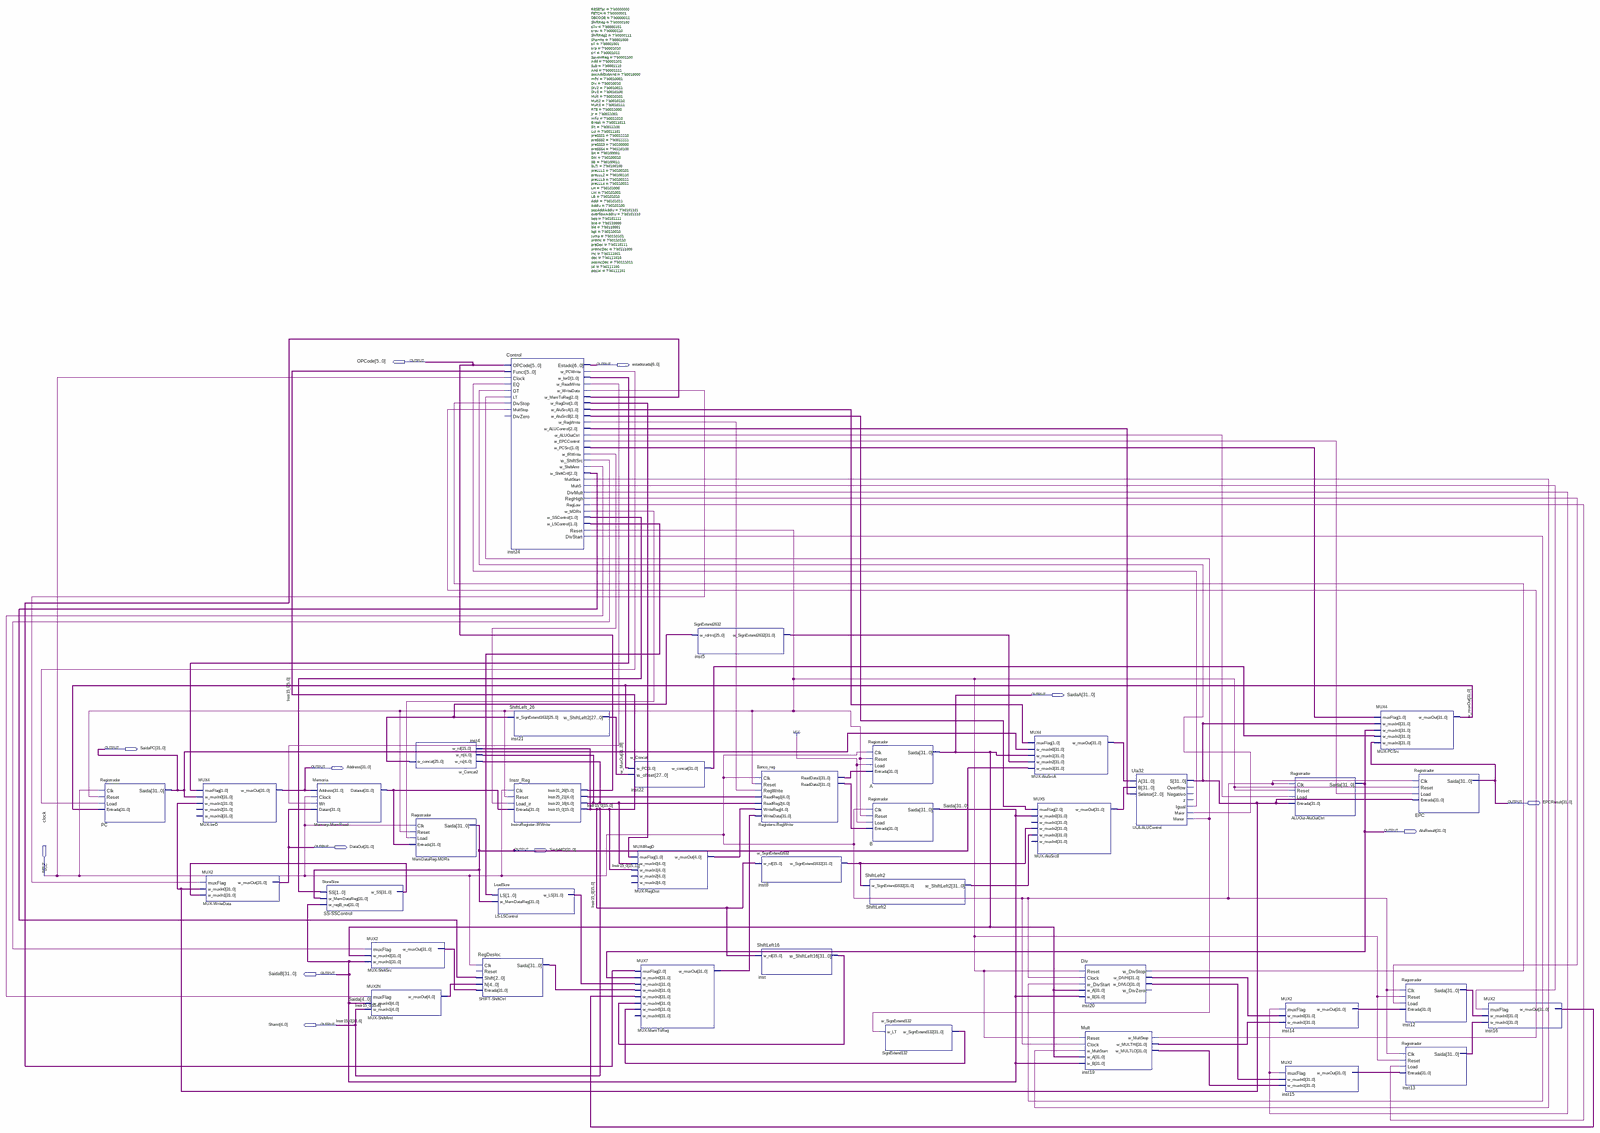
[diagram p0: schematic sheet, whole]
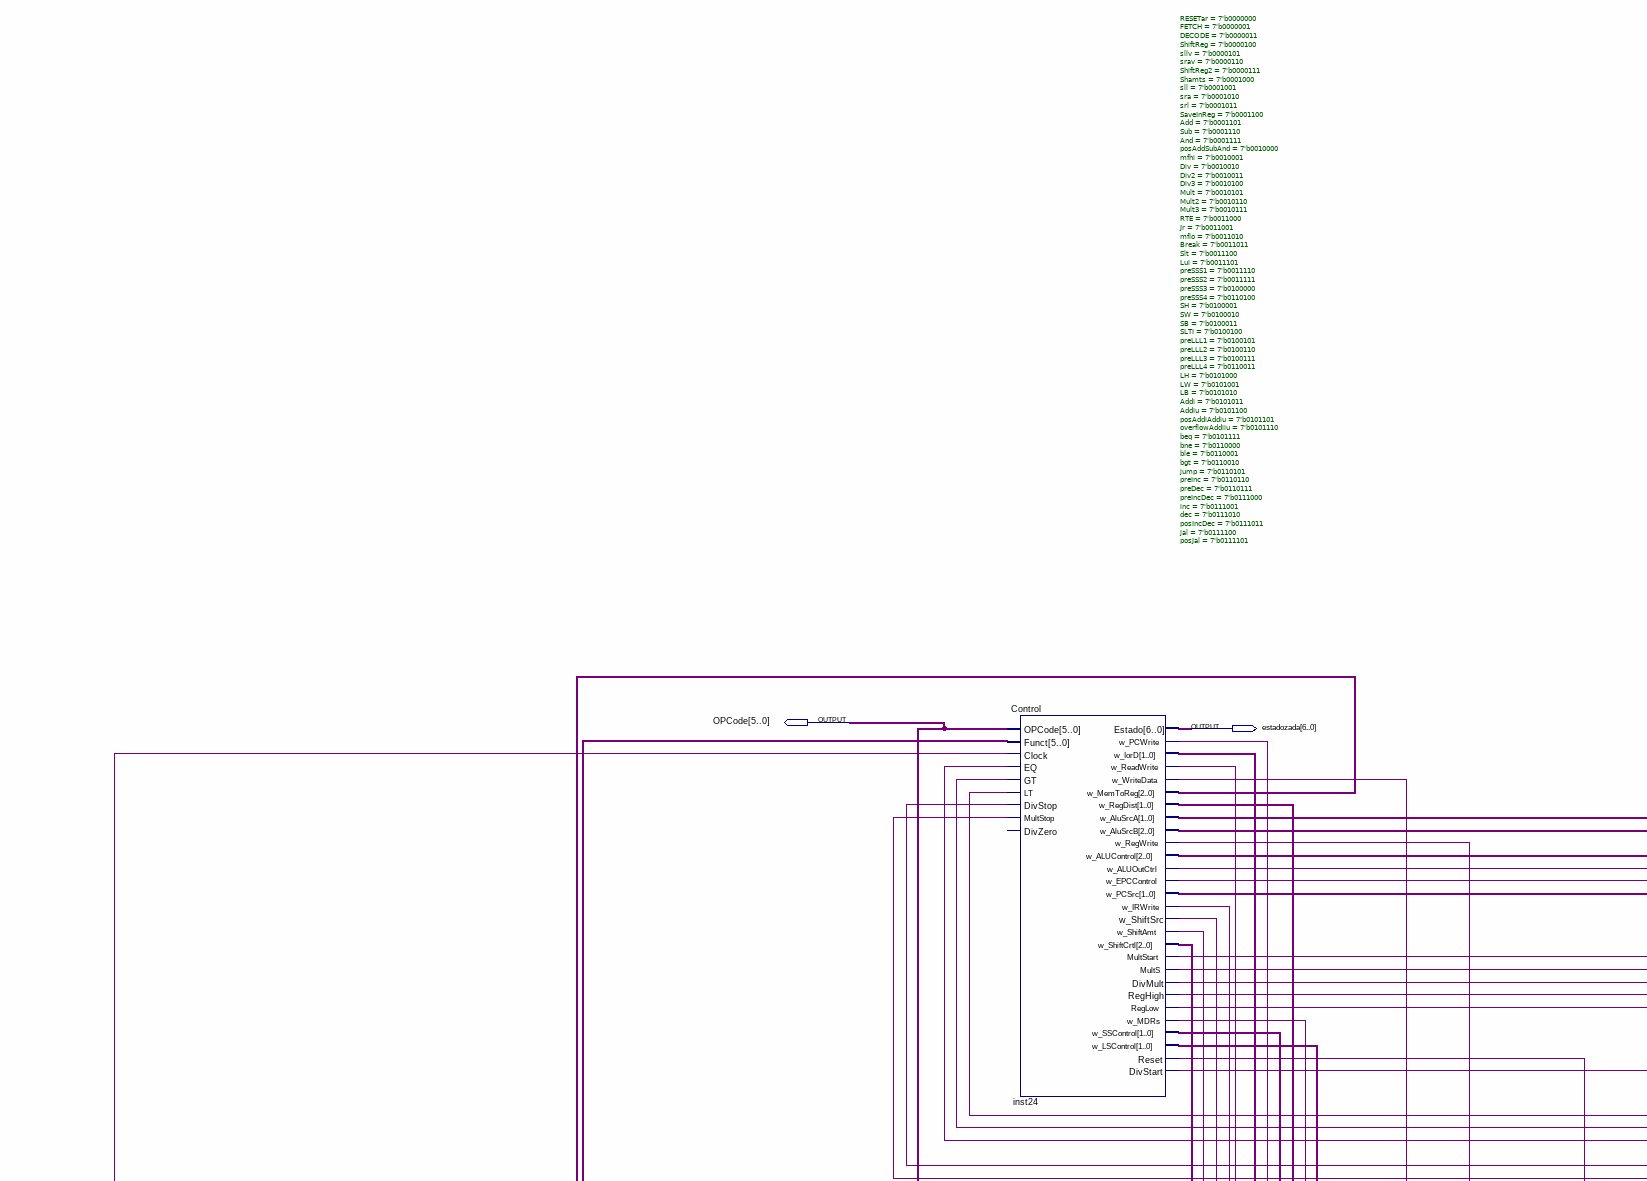
[diagram p1: schematic sheet, upper left part]
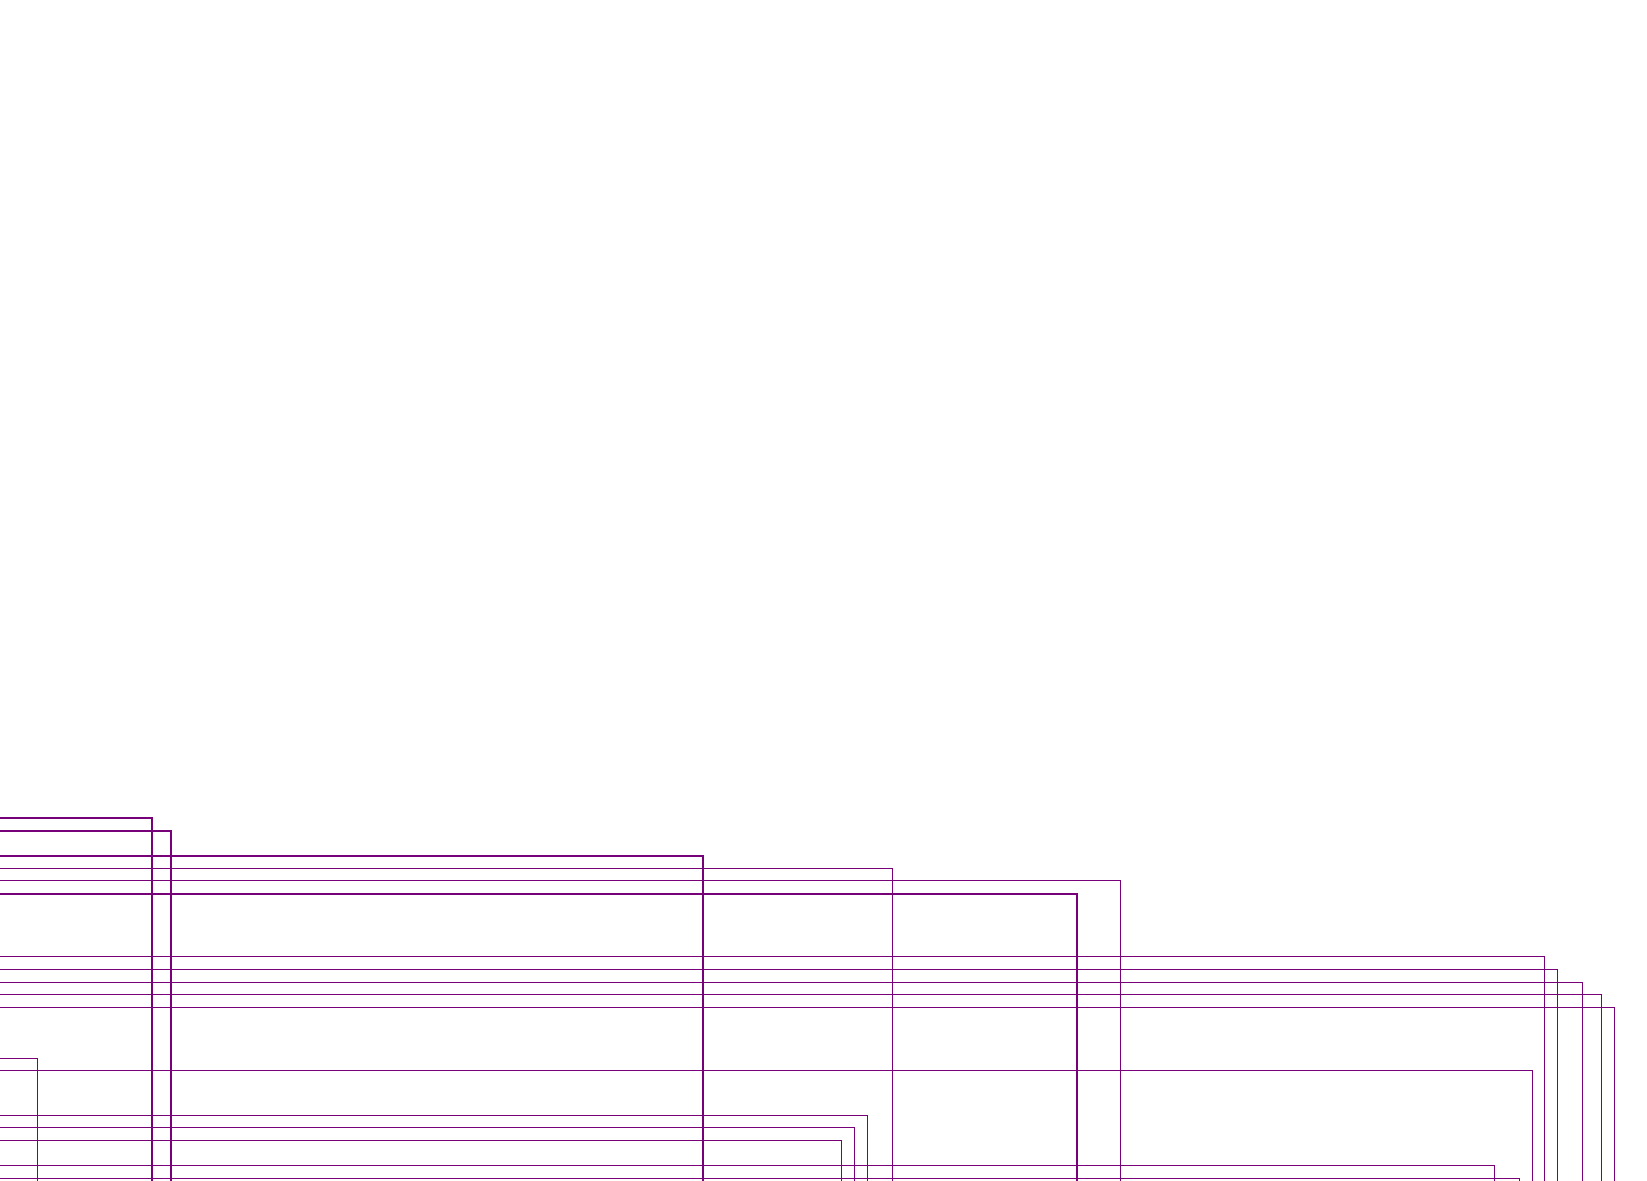
[diagram p2: schematic sheet, upper right part]
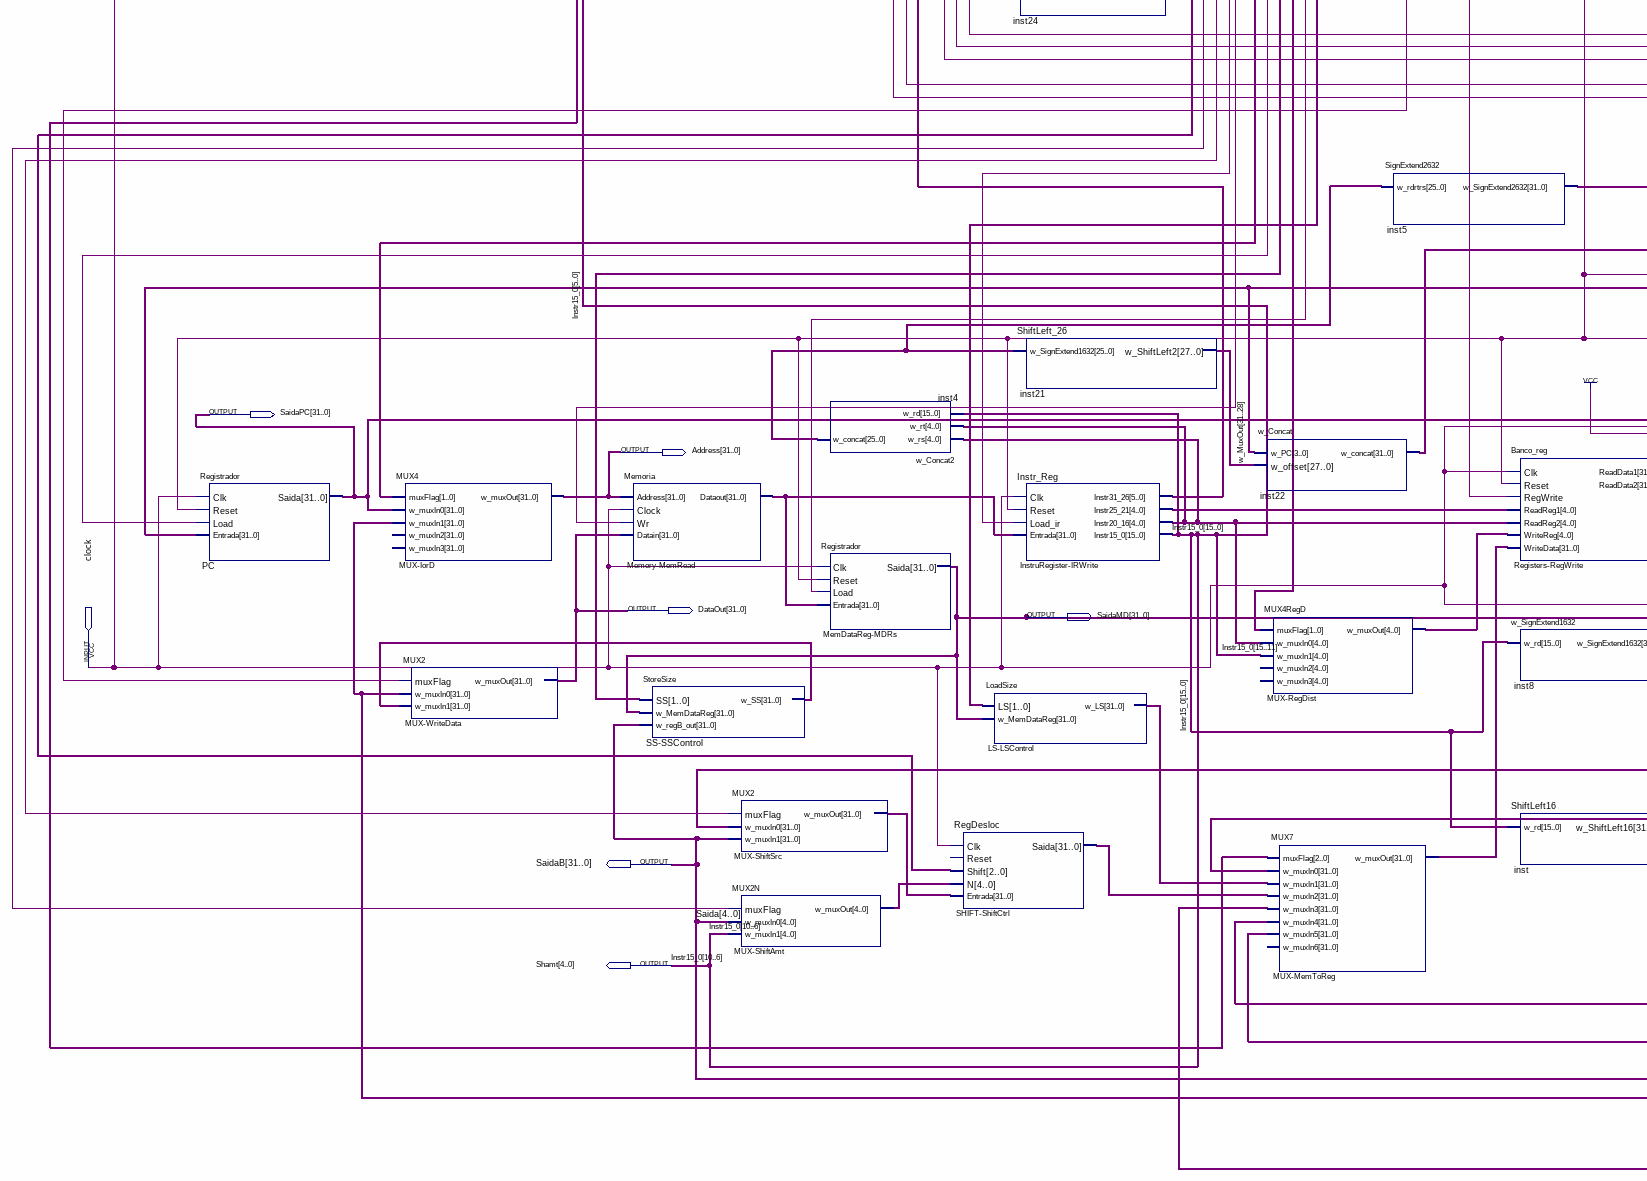
[diagram p3: schematic sheet, lower left part]
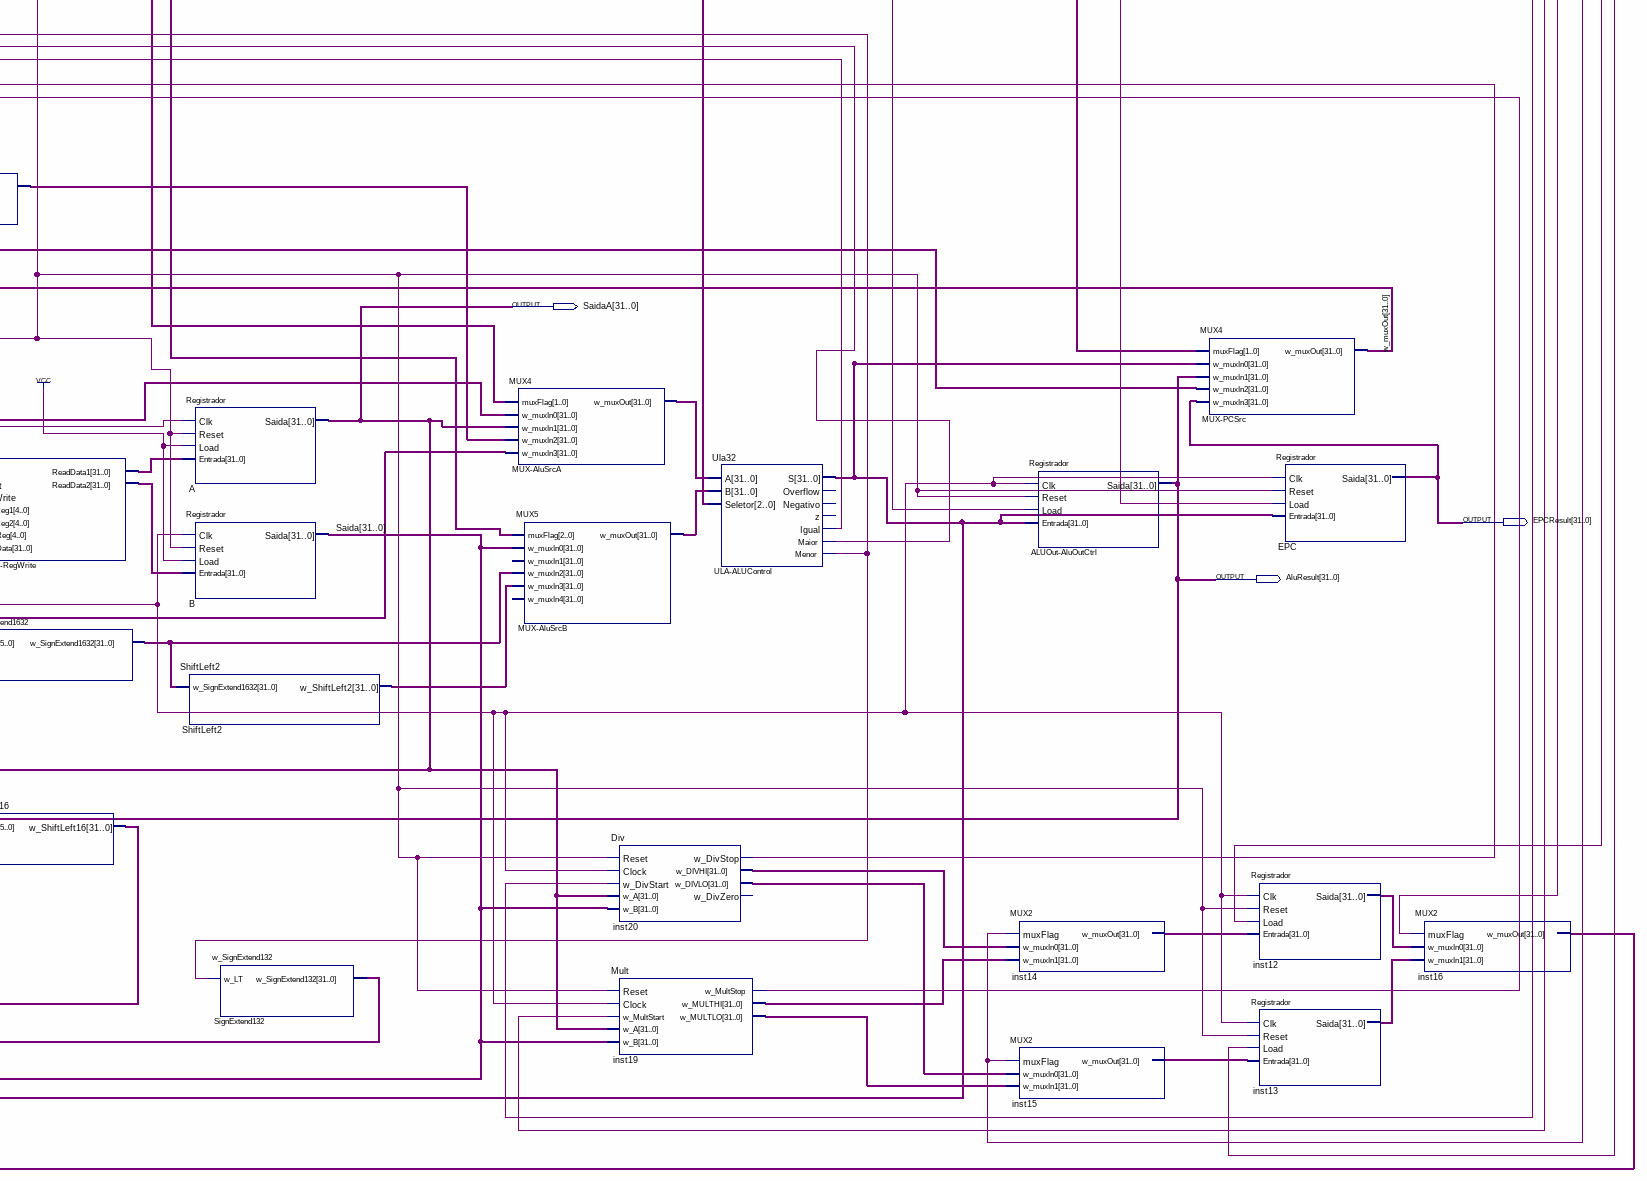
[diagram p4: schematic sheet, lower right part]
// Quartus schematic CPUbloco.bdf as structural Verilog: 38 symbols, 12 pins
module CPUbloco (
  input  clock,
  output [5:0] OPCode,
  output [6:0] estadozada,
  output [31:0] SaidaA,
  output [31:0] SaidaPC,
  output [31:0] Address,
  output [31:0] EPCResult,
  output [31:0] AluResult,
  output [31:0] DataOut,
  output [31:0] SaidaMD,
  output [31:0] SaidaB,
  output [4:0] Shamt
);

  wire inst19_w_multstop, inst20_w_divstop, inst24_divmult, inst24_divstart, inst24_mults, inst24_multstart,
       inst24_reghigh, inst24_reglow, inst24_reset, inst24_w_aluoutctrl, inst24_w_epccontrol,
       inst24_w_irwrite, inst24_w_mdrs, inst24_w_pcwrite, inst24_w_readwrite, inst24_w_regwrite,
       inst24_w_shiftamt, inst24_w_shiftsrc, inst24_w_writedata, ULA_ALUControl_igual, ULA_ALUControl_maior,
       ULA_ALUControl_menor;
  wire [1:0] inst24_w_alusrca, inst24_w_iord, inst24_w_lscontrol, inst24_w_pcsrc, inst24_w_regdist,
       inst24_w_sscontrol;
  wire [2:0] inst24_w_alucontrol, inst24_w_alusrcb, inst24_w_memtoreg, inst24_w_shiftcrtl;
  wire [4:0] InstruRegister_IRWrite_instr20_16, InstruRegister_IRWrite_instr25_21, MUX_RegDist_w_muxout,
       MUX_ShiftAmt_w_muxout;
  wire [15:0] Instr15_0;
  wire [25:0] inst4_w_concat;
  wire [27:0] inst21_w_shiftleft2;
  wire [31:0] inst5_w_signextend2632, inst8_w_signextend1632, inst12_saida, inst13_saida, inst14_w_muxout,
       inst15_w_muxout, inst16_w_muxout, inst19_w_multhi, inst19_w_multlo, inst20_w_divhi, inst20_w_divlo,
       inst22_w_concat, inst_w_shiftleft16, LS_LSControl_w_ls, Memory_MemRead_dataout, MUX_AluSrcA_w_muxout,
       MUX_AluSrcB_w_muxout, MUX_MemToReg_w_muxout, MUX_ShiftSrc_w_muxout, Registers_RegWrite_readdata1,
       Registers_RegWrite_readdata2, SHIFT_ShiftCtrl_saida, ShiftLeft2_w_shiftleft2,
       SignExtend132_w_signextend132, SS_SSControl_w_ss, ULA_ALUControl_s, w_MuxOut;

  Registrador PC (.Clk(clock), .Reset(inst24_reset), .Load(inst24_w_pcwrite), .Entrada(w_MuxOut), .Saida(SaidaPC));
  MUX4 \MUX-IorD  (
    .muxFlag(inst24_w_iord), .w_muxIn0(SaidaPC), .w_muxIn1(ULA_ALUControl_s), .w_muxOut(Address));  // open: w_muxIn2, w_muxIn3
  MUX2 \MUX-WriteData  (
    .muxFlag(inst24_w_writedata), .w_muxIn0(ULA_ALUControl_s), .w_muxIn1(SS_SSControl_w_ss),
    .w_muxOut(DataOut));
  Memoria \Memory-MemRead  (
    .Address(Address), .Clock(clock), .Wr(inst24_w_readwrite), .Datain(DataOut),
    .Dataout(Memory_MemRead_dataout));
  StoreSize \SS-SSControl  (
    .SS(inst24_w_sscontrol), .w_MemDataReg(SaidaMD), .w_regB_out(SaidaB), .w_SS(SS_SSControl_w_ss));
  MUX2 \MUX-ShiftSrc  (
    .muxFlag(inst24_w_shiftsrc), .w_muxIn0(SaidaA), .w_muxIn1(SaidaB), .w_muxOut(MUX_ShiftSrc_w_muxout));
  MUX2N \MUX-ShiftAmt  (
    .muxFlag(inst24_w_shiftamt), .w_muxIn0(SaidaB[4:0]), .w_muxIn1(Shamt), .w_muxOut(MUX_ShiftAmt_w_muxout));
  w_Concat2 inst4 (
    .w_rs(InstruRegister_IRWrite_instr20_16), .w_rt(InstruRegister_IRWrite_instr20_16),
    .w_rd({Instr15_0[15:11], Shamt, Instr15_0[5:0]}), .w_concat(inst4_w_concat));
  Registrador \MemDataReg-MDRs  (
    .Clk(clock), .Reset(inst24_reset), .Load(inst24_w_mdrs), .Entrada(Memory_MemRead_dataout), .Saida(SaidaMD));
  LoadSize \LS-LSControl  (.LS(inst24_w_lscontrol), .w_MemDataReg(SaidaMD), .w_LS(LS_LSControl_w_ls));
  RegDesloc \SHIFT-ShiftCtrl  (
    .Clk(clock), .Shift(inst24_w_shiftcrtl), .N(MUX_ShiftAmt_w_muxout), .Entrada(MUX_ShiftSrc_w_muxout),
    .Saida(SHIFT_ShiftCtrl_saida));  // open: Reset
  Control #(.RESETar(7'b0000000), .FETCH(7'b0000001), .DECODE(7'b0000011), .ShiftReg(7'b0000100), .sllv(7'b0000101), .srav(7'b0000110), .ShiftReg2(7'b0000111), .Shamts(7'b0001000), .sll(7'b0001001), .sra(7'b0001010), .srl(7'b0001011), .SaveInReg(7'b0001100), .Add(7'b0001101), .Sub(7'b0001110), .And(7'b0001111), .posAddSubAnd(7'b0010000), .mfhi(7'b0010001), .Div(7'b0010010), .Div2(7'b0010011), .Div3(7'b0010100), .Mult(7'b0010101), .Mult2(7'b0010110), .Mult3(7'b0010111), .RTE(7'b0011000), .Jr(7'b0011001), .mflo(7'b0011010), .Break(7'b0011011), .Slt(7'b0011100), .Lui(7'b0011101), .preSSS1(7'b0011110), .preSSS2(7'b0011111), .preSSS3(7'b0100000), .preSSS4(7'b0110100), .SH(7'b0100001), .SW(7'b0100010), .SB(7'b0100011), .SLTI(7'b0100100), .preLLL1(7'b0100101), .preLLL2(7'b0100110), .preLLL3(7'b0100111), .preLLL4(7'b0110011), .LH(7'b0101000), .LW(7'b0101001), .LB(7'b0101010), .Addi(7'b0101011), .Addiu(7'b0101100), .posAddiAddiu(7'b0101101), .overflowAddiiu(7'b0101110), .beq(7'b0101111), .bne(7'b0110000), .ble(7'b0110001), .bgt(7'b0110010), .jump(7'b0110101), .preInc(7'b0110110), .preDec(7'b0110111), .preIncDec(7'b0111000), .inc(7'b0111001), .dec(7'b0111010), .posIncDec(7'b0111011), .jal(7'b0111100), .posJal(7'b0111101)) inst24 (
    .OPCode(OPCode), .Funct(Instr15_0[5:0]), .Clock(clock), .EQ(ULA_ALUControl_igual),
    .GT(ULA_ALUControl_maior), .LT(ULA_ALUControl_menor), .DivStop(inst20_w_divstop),
    .MultStop(inst19_w_multstop), .Estado(estadozada), .w_PCWrite(inst24_w_pcwrite), .w_IorD(inst24_w_iord),
    .w_ReadWrite(inst24_w_readwrite), .w_WriteData(inst24_w_writedata), .w_MemToReg(inst24_w_memtoreg),
    .w_RegDist(inst24_w_regdist), .w_AluSrcA(inst24_w_alusrca), .w_AluSrcB(inst24_w_alusrcb),
    .w_RegWrite(inst24_w_regwrite), .w_ALUControl(inst24_w_alucontrol), .w_ALUOutCtrl(inst24_w_aluoutctrl),
    .w_EPCControl(inst24_w_epccontrol), .w_PCSrc(inst24_w_pcsrc), .w_IRWrite(inst24_w_irwrite),
    .w_ShiftSrc(inst24_w_shiftsrc), .w_ShiftAmt(inst24_w_shiftamt), .w_ShiftCrtl(inst24_w_shiftcrtl),
    .MultStart(inst24_multstart), .MultS(inst24_mults), .DivMult(inst24_divmult), .RegHigh(inst24_reghigh),
    .RegLow(inst24_reglow), .w_MDRs(inst24_w_mdrs), .w_SSControl(inst24_w_sscontrol),
    .w_LSControl(inst24_w_lscontrol), .Reset(inst24_reset), .DivStart(inst24_divstart));  // open: DivZero
  ShiftLeft_26 inst21 (.w_SignExtend1632(inst4_w_concat), .w_ShiftLeft2(inst21_w_shiftleft2));
  Instr_Reg \InstruRegister-IRWrite  (
    .Clk(clock), .Reset(inst24_reset), .Load_ir(inst24_w_irwrite), .Entrada(Memory_MemRead_dataout),
    .Instr31_26(OPCode), .Instr25_21(InstruRegister_IRWrite_instr25_21),
    .Instr20_16(InstruRegister_IRWrite_instr20_16), .Instr15_0({Instr15_0[15:11], Shamt, Instr15_0[5:0]}));
  w_Concat inst22 (.w_PC(w_MuxOut[31:28]), .w_offset(inst21_w_shiftleft2), .w_concat(inst22_w_concat));
  MUX4RegD \MUX-RegDist  (
    .muxFlag(inst24_w_regdist), .w_muxIn0(InstruRegister_IRWrite_instr20_16), .w_muxIn1(Instr15_0[15:11]),
    .w_muxOut(MUX_RegDist_w_muxout));  // open: w_muxIn2, w_muxIn3
  MUX7 \MUX-MemToReg  (
    .muxFlag(inst24_w_memtoreg), .w_muxIn0(AluResult), .w_muxIn1(LS_LSControl_w_ls),
    .w_muxIn2(SHIFT_ShiftCtrl_saida), .w_muxIn3(inst16_w_muxout), .w_muxIn4(inst_w_shiftleft16),
    .w_muxIn5(SignExtend132_w_signextend132), .w_muxOut(MUX_MemToReg_w_muxout));  // open: w_muxIn6
  SignExtend2632 inst5 (.w_rdrtrs(inst4_w_concat), .w_SignExtend2632(inst5_w_signextend2632));
  Banco_reg \Registers-RegWrite  (
    .Clk(clock), .Reset(inst24_reset), .RegWrite(inst24_w_regwrite),
    .ReadReg1(InstruRegister_IRWrite_instr25_21), .ReadReg2(InstruRegister_IRWrite_instr20_16),
    .WriteReg(MUX_RegDist_w_muxout), .WriteData(MUX_MemToReg_w_muxout),
    .ReadData1(Registers_RegWrite_readdata1), .ReadData2(Registers_RegWrite_readdata2));
  w_SignExtend1632 inst8 (.w_rd({Instr15_0[15:11], Shamt, Instr15_0[5:0]}), .w_SignExtend1632(inst8_w_signextend1632));
  ShiftLeft16 inst (.w_rd({Instr15_0[15:11], Shamt, Instr15_0[5:0]}), .w_ShiftLeft16(inst_w_shiftleft16));
  Registrador A (
    .Clk(clock), .Reset(inst24_reset), .Load(1'b1), .Entrada(Registers_RegWrite_readdata1), .Saida(SaidaA));
  Registrador B (
    .Clk(clock), .Reset(inst24_reset), .Load(1'b1), .Entrada(Registers_RegWrite_readdata2), .Saida(SaidaB));
  ShiftLeft2 ShiftLeft2 (.w_SignExtend1632(inst8_w_signextend1632), .w_ShiftLeft2(ShiftLeft2_w_shiftleft2));
  w_SignExtend132 SignExtend132 (.w_LT(ULA_ALUControl_menor), .w_SignExtend132(SignExtend132_w_signextend132));
  MUX4 \MUX-AluSrcA  (
    .muxFlag(inst24_w_alusrca), .w_muxIn0(SaidaPC), .w_muxIn1(SaidaA), .w_muxIn2(inst5_w_signextend2632),
    .w_muxIn3(SaidaMD), .w_muxOut(MUX_AluSrcA_w_muxout));
  MUX5 \MUX-AluSrcB  (
    .muxFlag(inst24_w_alusrcb), .w_muxIn0(SaidaB), .w_muxIn2(inst8_w_signextend1632),
    .w_muxIn3(ShiftLeft2_w_shiftleft2), .w_muxOut(MUX_AluSrcB_w_muxout));  // open: w_muxIn1, w_muxIn4
  Div inst20 (
    .Reset(inst24_reset), .Clock(clock), .w_DivStart(inst24_divstart), .w_A(SaidaA), .w_B(SaidaB),
    .w_DivStop(inst20_w_divstop), .w_DIVHI(inst20_w_divhi), .w_DIVLO(inst20_w_divlo));  // open: w_DivZero
  Mult inst19 (
    .Reset(inst24_reset), .Clock(clock), .w_MultStart(inst24_multstart), .w_A(SaidaA), .w_B(SaidaB),
    .w_MultStop(inst19_w_multstop), .w_MULTHI(inst19_w_multhi), .w_MULTLO(inst19_w_multlo));
  Ula32 \ULA-ALUControl  (
    .A(MUX_AluSrcA_w_muxout), .B(MUX_AluSrcB_w_muxout), .Seletor(inst24_w_alucontrol), .S(ULA_ALUControl_s),
    .Igual(ULA_ALUControl_igual), .Maior(ULA_ALUControl_maior), .Menor(ULA_ALUControl_menor));  // open: Overflow, Negativo, z
  MUX2 inst14 (
    .muxFlag(inst24_divmult), .w_muxIn0(inst20_w_divhi), .w_muxIn1(inst19_w_multhi),
    .w_muxOut(inst14_w_muxout));
  MUX2 inst15 (
    .muxFlag(inst24_divmult), .w_muxIn0(inst20_w_divlo), .w_muxIn1(inst19_w_multlo),
    .w_muxOut(inst15_w_muxout));
  Registrador \ALUOut-AluOutCtrl  (
    .Clk(clock), .Reset(inst24_reset), .Load(inst24_w_aluoutctrl), .Entrada(ULA_ALUControl_s),
    .Saida(AluResult));
  MUX4 \MUX-PCSrc  (
    .muxFlag(inst24_w_pcsrc), .w_muxIn0(ULA_ALUControl_s), .w_muxIn1(AluResult), .w_muxIn2(inst22_w_concat),
    .w_muxIn3(EPCResult), .w_muxOut(w_MuxOut));
  Registrador EPC (
    .Clk(clock), .Reset(inst24_reset), .Load(inst24_w_epccontrol), .Entrada(ULA_ALUControl_s),
    .Saida(EPCResult));
  Registrador inst12 (
    .Clk(clock), .Reset(inst24_reset), .Load(inst24_reghigh), .Entrada(inst14_w_muxout), .Saida(inst12_saida));
  Registrador inst13 (
    .Clk(clock), .Reset(inst24_reset), .Load(inst24_reglow), .Entrada(inst15_w_muxout), .Saida(inst13_saida));
  MUX2 inst16 (.muxFlag(inst24_mults), .w_muxIn0(inst12_saida), .w_muxIn1(inst13_saida), .w_muxOut(inst16_w_muxout));

  // Other names for the same wires on the sheet: Instr15_0[10:6] = Shamt; Saida[31:0] = SaidaB
endmodule
